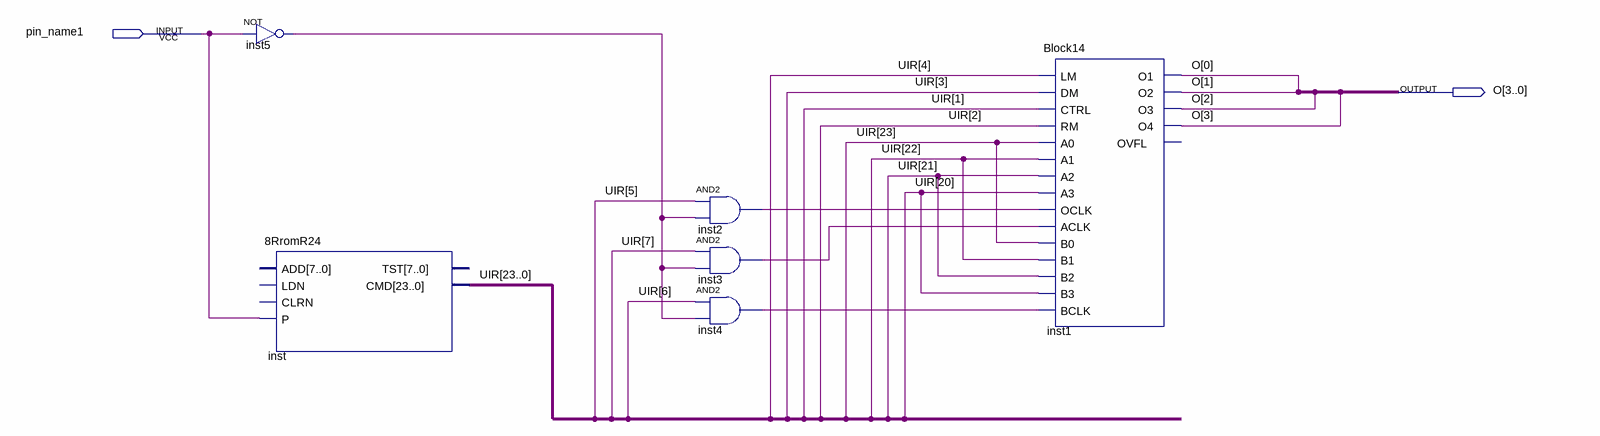
[diagram p0: schematic sheet]
// Quartus schematic exp14.bdf as structural Verilog: 6 symbols, 2 pins
module exp14 (
  input  pin_name1,
  output [3:0] O
);

  wire inst2_out, inst3_out, inst4_out, inst5_out;
  wire [23:0] UIR;

  not inst5 (inst5_out, pin_name1);
  \8RromR24  inst (.P(pin_name1), .CMD(UIR));  // open: ADD, LDN, CLRN, TST
  and inst2 (inst2_out, UIR[5], inst5_out);
  and inst3 (inst3_out, UIR[7], inst5_out);
  and inst4 (inst4_out, UIR[6], inst5_out);
  Block14 inst1 (
    .LM(UIR[4]), .DM(UIR[3]), .CTRL(UIR[1]), .RM(UIR[2]), .A0(UIR[23]), .A1(UIR[22]), .A2(UIR[21]),
    .A3(UIR[20]), .OCLK(inst2_out), .ACLK(inst3_out), .B0(UIR[23]), .B1(UIR[22]), .B2(UIR[21]), .B3(UIR[20]),
    .BCLK(inst4_out), .O1(O[0]), .O2(O[1]), .O3(O[2]), .O4(O[3]));  // open: OVFL
endmodule
